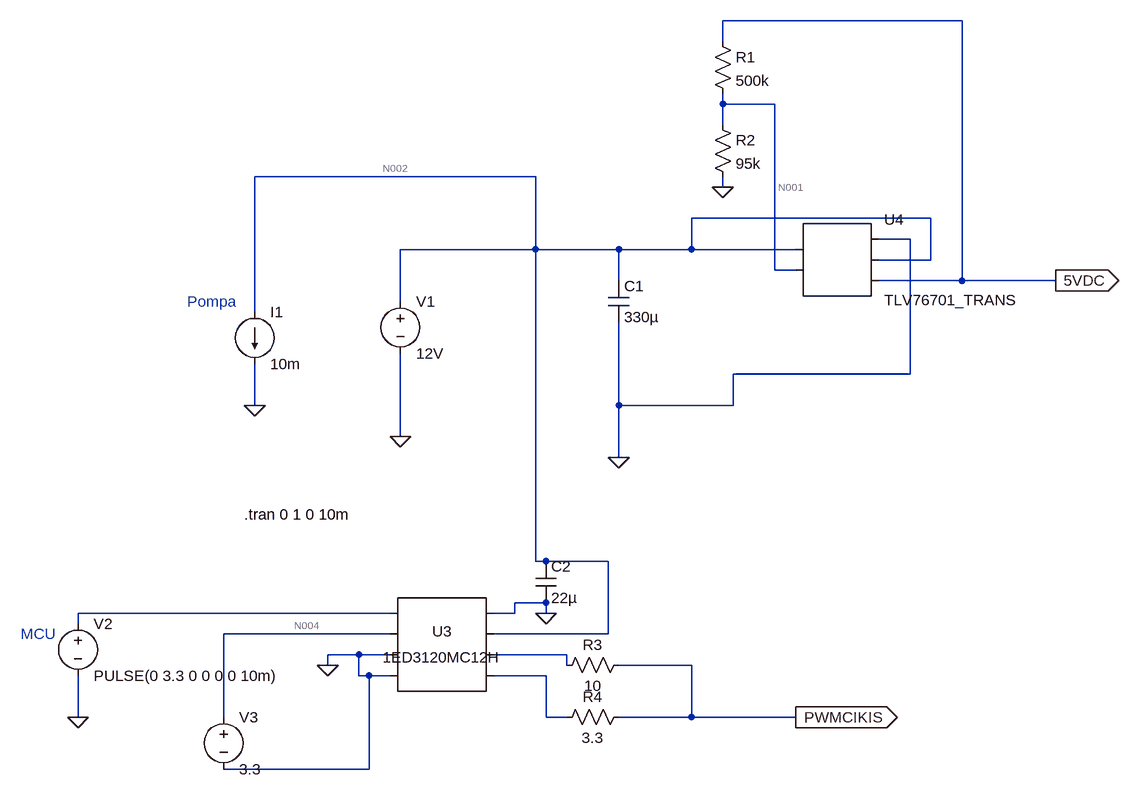
[diagram p0: schematic Draft1.asc]
Draft1.asc, the LTspice schematic file:
Version 4
SHEET 1 1972 944
WIRE 1424 -224 1056 -224
WIRE 1056 -192 1056 -224
WIRE 1056 -96 1056 -112
WIRE 1136 -96 1056 -96
WIRE 1056 -64 1056 -96
WIRE 768 16 336 16
WIRE 1056 32 1056 16
WIRE 1376 80 1008 80
WIRE 1344 112 1296 112
WIRE 768 128 768 16
WIRE 768 128 560 128
WIRE 896 128 768 128
WIRE 1008 128 1008 80
WIRE 1008 128 896 128
WIRE 1168 128 1008 128
WIRE 1376 144 1376 80
WIRE 1376 144 1296 144
WIRE 1136 160 1136 -96
WIRE 1168 160 1136 160
WIRE 896 176 896 128
WIRE 1424 176 1424 -224
WIRE 1424 176 1296 176
WIRE 1568 176 1424 176
WIRE 560 208 560 128
WIRE 336 224 336 16
WIRE 1344 320 1344 112
WIRE 1344 320 1072 320
WIRE 336 368 336 304
WIRE 896 368 896 240
WIRE 1072 368 1072 320
WIRE 1072 368 896 368
WIRE 560 416 560 288
WIRE 896 448 896 368
WIRE 768 608 768 128
WIRE 784 608 768 608
WIRE 880 608 784 608
WIRE 784 672 736 672
WIRE 544 688 64 688
WIRE 736 688 736 672
WIRE 736 688 704 688
WIRE 784 688 784 672
WIRE 64 704 64 688
WIRE 544 720 288 720
WIRE 880 720 880 608
WIRE 880 720 704 720
WIRE 496 752 448 752
WIRE 544 752 496 752
WIRE 816 752 704 752
WIRE 448 768 448 752
WIRE 816 768 816 752
WIRE 1008 768 896 768
WIRE 496 784 496 752
WIRE 512 784 496 784
WIRE 544 784 512 784
WIRE 784 784 704 784
WIRE 64 848 64 784
WIRE 288 848 288 720
WIRE 784 848 784 784
WIRE 816 848 784 848
WIRE 1008 848 1008 768
WIRE 1008 848 896 848
WIRE 1168 848 1008 848
WIRE 512 928 512 784
WIRE 512 928 288 928
FLAG 896 448 0
FLAG 1056 32 0
FLAG 64 848 0
FLAG 448 768 0
FLAG 784 688 0
FLAG 336 368 0
FLAG 560 416 0
FLAG 1168 848 PWMCIKIS
IOPIN 1168 848 Out
FLAG 1568 176 5VDC
IOPIN 1568 176 Out
SYMBOL cap 880 176 R0
SYMATTR InstName C1
SYMATTR Value 330µ
SYMBOL res 1040 -208 R0
SYMATTR InstName R1
SYMATTR Value 500k
SYMBOL res 1040 -80 R0
SYMATTR InstName R2
SYMATTR Value 95k
SYMBOL voltage 64 688 R0
WINDOW 123 0 0 Left 0
WINDOW 39 0 0 Left 0
SYMATTR InstName V2
SYMATTR Value PULSE(0 3.3 0 0 0 0 10m)
SYMBOL cap 768 608 R0
SYMATTR InstName C2
SYMATTR Value 22µ
SYMBOL voltage 288 832 R0
WINDOW 123 0 0 Left 0
WINDOW 39 0 0 Left 0
SYMATTR InstName V3
SYMATTR Value 3.3
SYMBOL res 912 752 R90
WINDOW 0 0 56 VBottom 2
WINDOW 3 32 56 VTop 2
SYMATTR InstName R3
SYMATTR Value 10
SYMBOL res 912 832 R90
WINDOW 0 0 56 VBottom 2
WINDOW 3 32 56 VTop 2
SYMATTR InstName R4
SYMATTR Value 3.3
SYMBOL current 336 224 R0
WINDOW 123 0 0 Left 0
WINDOW 39 0 0 Left 0
SYMATTR InstName I1
SYMATTR Value 10m
SYMBOL voltage 560 192 R0
WINDOW 123 0 0 Left 0
WINDOW 39 0 0 Left 0
SYMATTR InstName V1
SYMATTR Value 12V
SYMBOL AutoGenerated\\1ED3120MC12H 624 736 R0
SYMATTR InstName U3
SYMBOL AutoGenerated\\TLV76701_TRANS 1232 144 R0
SYMATTR InstName U4
TEXT 320 536 Left 2 !.tran 0 1 0 10m
TEXT 232 208 Left 2 ;Pompa
TEXT -24 720 Left 2 ;MCU

The netlist it stands for:
* Draft1.asc
C1 N002 0 330µ
R1 5VDC N001 500k
R2 N001 0 95k
V2 N003 0 PULSE(0 3.3 0 0 0 0 10m)
C2 N002 0 22µ
V3 N004 0 3.3
R3 PWMCIKIS N005 10
R4 PWMCIKIS N006 3.3
I1 N002 0 10m
V1 N002 0 12V
* U3: 1ED3120MC12H (symbol AutoGenerated\1ED3120MC12H not available, pins judged from their places): pin1=N003 pin2=N004 pin3=0 pin4=0 pin5=0 pin6=N002 pin7=N005 pin8=N006
* U4: TLV76701_TRANS (symbol AutoGenerated\TLV76701_TRANS not available, pins judged from their places): pin1=N002 pin2=N001 pin3=0 pin4=N002 pin5=5VDC
.tran 0 1 0 10m
* Pompa
* MCU
.backanno
.end

* Results of the author's LTspice run, read from the files saved beside the schematic
* Operating Point, zero values left out:
*   V(n002) = 12 V
*   V(5vdc) = 4.293 mV
*   V(n001) = 685.5 µV
*   V(n004) = 3.3 V
*   I(I1) = 10 mA
*   I(R1) = 7.216 nA
*   I(R2) = 7.216 nA
*   I(R3) = -36.01 pA
*   I(R4) = 36.01 pA
*   I(V3) = -44 µA
*   I(V1) = -11.02 mA
*   Ix(u3:INP) = 44 µA
*   Ix(u3:GND1) = -44 µA
*   Ix(u3:VEE2) = -1.2 mA
*   Ix(u3:VCC2) = 1.2 mA
*   Ix(u3:OUTP) = -36.01 pA
*   Ix(u3:OUTN) = 36.01 pA
*   Ix(u4:EN) = 1.2 µA
*   Ix(u4:GND) = 180.2 µA
*   Ix(u4:VIN) = -182.6 µA
*   Ix(u4:VOUT) = -7.216 nA